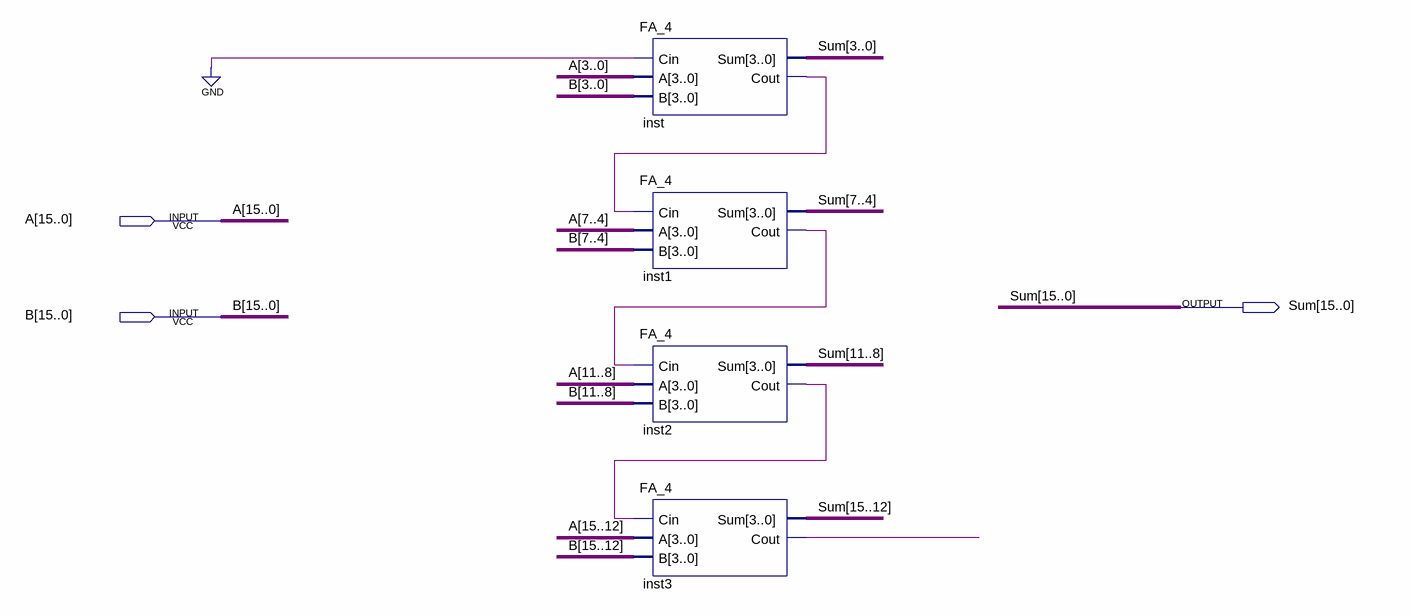
[diagram p0: schematic sheet]
// Quartus schematic FA_16.bdf as structural Verilog: 4 symbols, 3 pins
module FA_16 (
  input  [15:0] A,
  input  [15:0] B,
  output [15:0] Sum
);

  wire inst1_cout, inst2_cout, inst3_cout, inst_cout;

  FA_4 inst (.Cin(1'b0), .A(A[3:0]), .B(B[3:0]), .Sum(Sum[3:0]), .Cout(inst_cout));
  FA_4 inst1 (.Cin(inst_cout), .A(A[7:4]), .B(B[7:4]), .Sum(Sum[7:4]), .Cout(inst1_cout));
  FA_4 inst2 (.Cin(inst1_cout), .A(A[11:8]), .B(B[11:8]), .Sum(Sum[11:8]), .Cout(inst2_cout));
  FA_4 inst3 (.Cin(inst2_cout), .A(A[15:12]), .B(B[15:12]), .Sum(Sum[15:12]), .Cout(inst3_cout));
endmodule
